# Altium project PCB_Project.PrjPcb
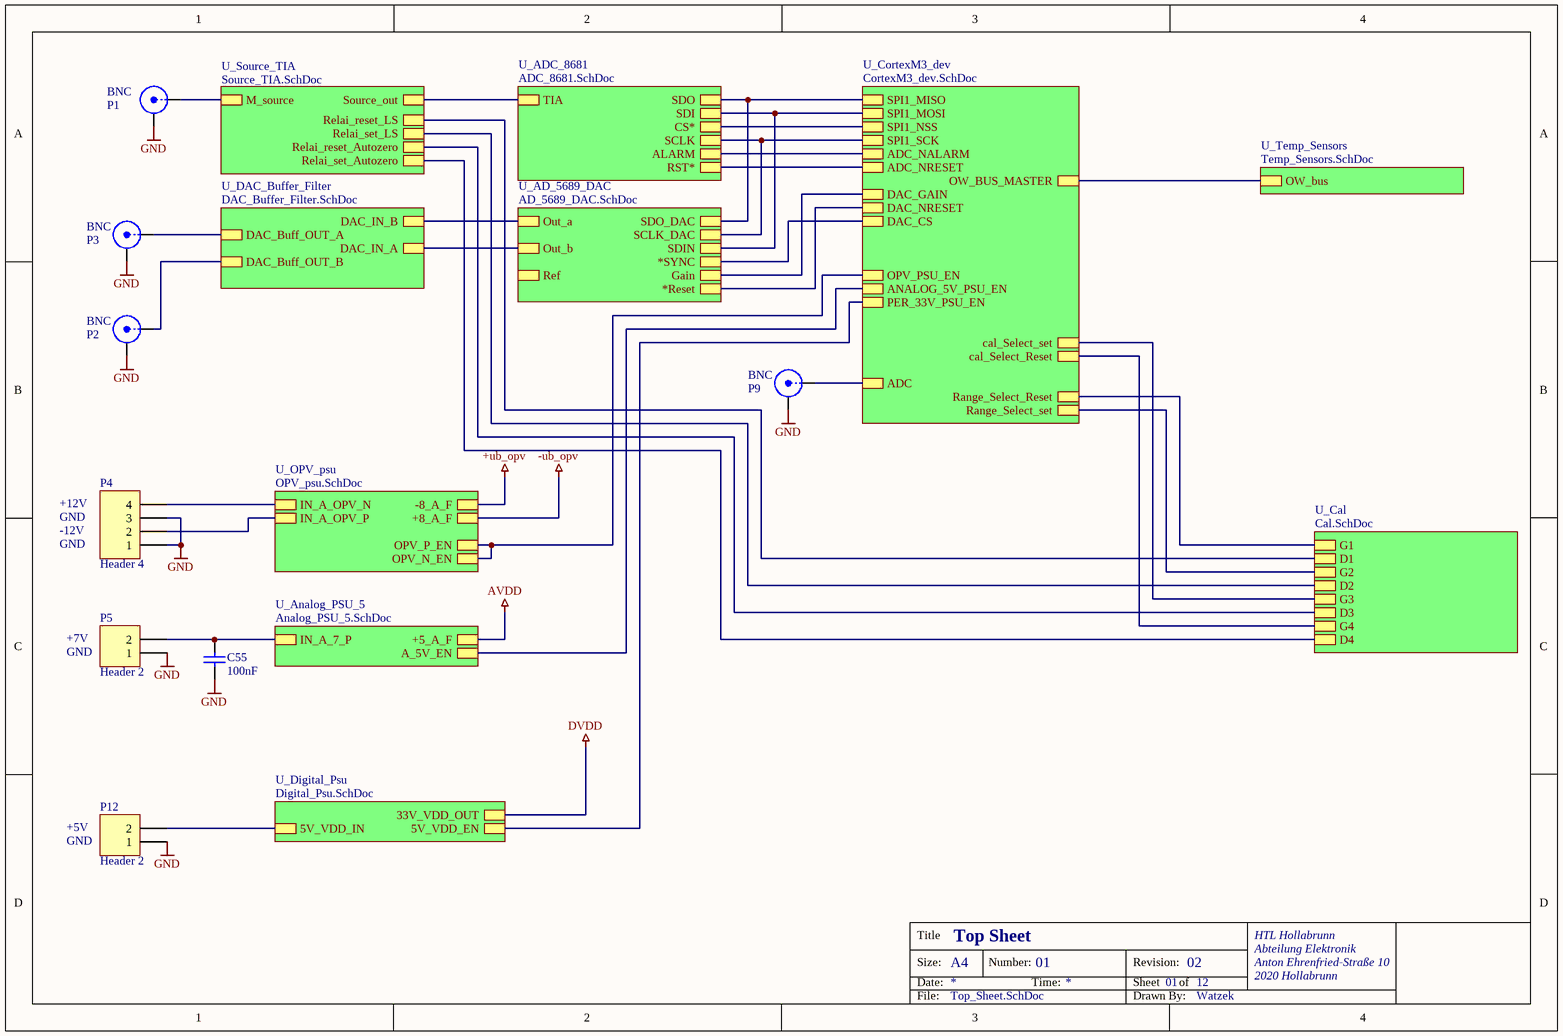
[diagram p0: Top_Sheet.SchDoc]
11 sheets, 114 parts. Net scope: hierarchical (ports join the sheet entries above them; power ports are global).
Board file: PCB1.PcbDoc
Sheets:
  Top_Sheet.SchDoc
    U_Source_TIA = Source_TIA.SchDoc
    U_DAC_Buffer_Filter = DAC_Buffer_Filter.SchDoc
    U_ADC_8681 = ADC_8681.SchDoc
    U_AD_5689_DAC = AD_5689_DAC.SchDoc
    U_Temp_Sensors = Temp_Sensors.SchDoc
    U_Digital_Psu = Digital_Psu.SchDoc
    U_Analog_PSU_5 = Analog_PSU_5.SchDoc
    U_OPV_psu = OPV_psu.SchDoc
    U_CortexM3_dev = CortexM3_dev.SchDoc
    U_Cal = Cal.SchDoc

## Sheet Top_Sheet.SchDoc: Top Sheet
size A4; ApprovedBy: Watzek; CheckedBy: Watzek; Author: Watzek; DrawnBy: Watzek; Organization: HTL Hollabrunn; Address1: Abteilung Elektronik; Address2: Anton Ehrenfried-Straße 10; Address3: 2020 Hollabrunn; DocumentNumber: 01; Revision: 02; SheetNumber: 01; SheetTotal: 12; SPICEModelCacheIHPBHSPQ: <root> / <DocumentId>IHPBHSPQ</DocumentId> / <CacheFrame Number="0"> / <Model Name="cap" Kind="MDL"> / <Text>*Default semiconductor capacitor / .MODEL CAP C()</Text> / </Model> / </CacheFrame> / </root>

### Parts
C55  100nF  [C1206-KUE]
P1  BNC  [BNC_RA CON]
P2  BNC  [BNC_RA CON]
P3  BNC  [BNC_RA CON]
P4  Header 4  [HDR1X4]
P5  Header 2  [HDR1X2]
P9  BNC  [BNC_RA CON]
P12  Header 2  [HDR1X2]

### Sub-sheets
U_AD_5689_DAC = AD_5689_DAC.SchDoc: Ref, Out_a, Out_b, SDIN, SDO_DAC, SCLK_DAC, *SYNC, Gain, *Reset
U_ADC_8681 = ADC_8681.SchDoc: SDI, CS*, SCLK, SDO, ALARM, RST*, TIA
U_Analog_PSU_5 = Analog_PSU_5.SchDoc: IN_A_7_P, +5_A_F, A_5V_EN
U_Cal = Cal.SchDoc: G1, G2, D1, D2, G3, D3, G4, D4
U_CortexM3_dev = CortexM3_dev.SchDoc: SPI1_NSS, SPI1_SCK, SPI1_MISO, SPI1_MOSI, ADC_NALARM, ADC_NRESET, DAC_GAIN, DAC_NRESET, DAC_CS, OW_BUS_MASTER, OPV_PSU_EN, ANALOG_5V_PSU_EN, PER_33V_PSU_EN, Range_Select_set, Range_Select_Reset, ADC, cal_Select_Reset, cal_Select_set
U_DAC_Buffer_Filter = DAC_Buffer_Filter.SchDoc: DAC_IN_B, DAC_Buff_OUT_B, DAC_IN_A, DAC_Buff_OUT_A
U_Digital_Psu = Digital_Psu.SchDoc: 5V_VDD_IN, 33V_VDD_OUT, 5V_VDD_EN
U_OPV_psu = OPV_psu.SchDoc: IN_A_OPV_P, +8_A_F, IN_A_OPV_N, -8_A_F, OPV_P_EN, OPV_N_EN
U_Source_TIA = Source_TIA.SchDoc: M_source, Source_out, Relai_set_LS, Relai_reset_LS, Relai_reset_Autozero, Relai_set_Autozero
U_Temp_Sensors = Temp_Sensors.SchDoc: OW_bus

### Nets
GND: C55.1 P1.2(Y) P2.2(Y) P3.2(Y) P4.1 P4.3 P5.1 P9.2(Y) P12.1
M_source: P1.1(X) ; sheet U_Source_TIA/M_source
SPI1_MISO: sheet U_ADC_8681/SDO, sheet U_AD_5689_DAC/SDO_DAC, sheet U_CortexM3_dev/SPI1_MISO
SPI1_MOSI: sheet U_ADC_8681/SDI, sheet U_AD_5689_DAC/SDIN, sheet U_CortexM3_dev/SPI1_MOSI
SPI1_SCK: sheet U_ADC_8681/SCLK, sheet U_AD_5689_DAC/SCLK_DAC, sheet U_CortexM3_dev/SPI1_SCK
NetC36_2: P12.2 ; sheet U_Digital_Psu/5V_VDD_IN
NetC47_2: P4.2 ; sheet U_OPV_psu/IN_A_OPV_P
NetC49_2: P4.4 ; sheet U_OPV_psu/IN_A_OPV_N
NetC55_2: C55.2 P5.2 ; sheet U_Analog_PSU_5/IN_A_7_P
NetD5_2: sheet U_Source_TIA/Relai_set_LS, sheet U_Cal/D2
NetD6_2: sheet U_Source_TIA/Relai_reset_LS, sheet U_Cal/D1
NetD7_2: sheet U_Source_TIA/Relai_reset_Autozero, sheet U_Cal/D3
NetD8_2: sheet U_Source_TIA/Relai_set_Autozero, sheet U_Cal/D4
NetN3_7: sheet U_Source_TIA/Source_out, sheet U_ADC_8681/TIA
NetN3_11: sheet U_ADC_8681/CS*, sheet U_CortexM3_dev/SPI1_NSS
NetN3_14: sheet U_ADC_8681/ALARM, sheet U_CortexM3_dev/ADC_NALARM
NetN4_1: sheet U_AD_5689_DAC/*Reset, sheet U_CortexM3_dev/DAC_NRESET
NetN4_2: P9.1(X) ; sheet U_CortexM3_dev/ADC
NetN4_3: sheet U_AD_5689_DAC/*SYNC, sheet U_CortexM3_dev/DAC_CS
NetN4_4: sheet U_AD_5689_DAC/Gain, sheet U_CortexM3_dev/DAC_GAIN
NetN4_9: sheet U_CortexM3_dev/cal_Select_set, sheet U_Cal/G3
NetN4_10: sheet U_CortexM3_dev/cal_Select_Reset, sheet U_Cal/G4
NetN4_11: sheet U_CortexM3_dev/Range_Select_set, sheet U_Cal/G2
NetN4_12: sheet U_CortexM3_dev/Range_Select_Reset, sheet U_Cal/G1
NetN4_13: sheet U_OPV_psu/OPV_P_EN, sheet U_OPV_psu/OPV_N_EN, sheet U_CortexM3_dev/OPV_PSU_EN
NetN4_20: sheet U_Analog_PSU_5/A_5V_EN, sheet U_CortexM3_dev/ANALOG_5V_PSU_EN
NetN4_21: sheet U_Temp_Sensors/OW_bus, sheet U_CortexM3_dev/OW_BUS_MASTER
NetN4_23: sheet U_Digital_Psu/5V_VDD_EN, sheet U_CortexM3_dev/PER_33V_PSU_EN
NetN4_27: sheet U_ADC_8681/RST*, sheet U_CortexM3_dev/ADC_NRESET
NetP2_1: P2.1(X) ; sheet U_DAC_Buffer_Filter/DAC_Buff_OUT_B
NetP3_1: P3.1(X) ; sheet U_DAC_Buffer_Filter/DAC_Buff_OUT_A
NetR19_1: sheet U_DAC_Buffer_Filter/DAC_IN_B, sheet U_AD_5689_DAC/Out_a
NetR20_1: sheet U_DAC_Buffer_Filter/DAC_IN_A, sheet U_AD_5689_DAC/Out_b

### Notes on the sheet
- +12V
- GND
- -12V
- +7V
- +5V
- Title
- Size:
- Date:
- A4
- Number:
- Time:
- Revision:
- Sheet
- of
- HTL Hollabrunn
- Abteilung Elektronik
- Anton Ehrenfried-Straße 10
- 2020 Hollabrunn
- File:
- Drawn By:

### Library data of the parts
C55 = Capacitor: Manufacturer: Kemet; Bezeichnung: Kerko +-10% 63V; Published: 8-Jun-2000; LatestRevisionDate: 17-Jul-2002; LatestRevisionNote: Re-released for DXP Platform.; PackageReference: RAD-0.3; Publisher: Altium Limited; PackageDescription: Radial Cap, Thru-Hole; 2 Leads; 0.3 in Pin Spacing; Value: 100nF; Orderingcode: *
P1-P3 P9 = BNC: BNC Elbow Connector; LatestRevisionDate: 17-Jul-2002; LatestRevisionNote: Re-released for DXP Platform.; Publisher: Altium Limited
P4 = Header 4: Header, 4-Pin; LatestRevisionDate: 17-Jul-2002; LatestRevisionNote: Re-released for DXP Platform.; Publisher: Altium Limited
P5 P12 = Header 2: Header, 2-Pin; LatestRevisionDate: 17-Jul-2002; LatestRevisionNote: Re-released for DXP Platform.; Publisher: Altium Limited

## Sheet Source_TIA.SchDoc: TIA and damper
size A4; Author: Watzek; DrawnBy: Watzek; Organization: HTL Hollabrunn; Address1: Abteilung Elektronik; Address2: Anton Ehrenfried-Straße 10; Address3: 2020 Hollabrunn; DocumentNumber: 02; Revision: 02; SheetNumber: 02; SheetTotal: 12; SPICEModelCacheBSQSHVBX: <root> / <DocumentId>BSQSHVBX</DocumentId> / <CacheFrame Number="0"> / <Model Name="cap" Kind="MDL"> / <Text>*Default semiconductor capacitor / .MODEL CAP C()</Text> / </Model> / </CacheFrame> / </root>
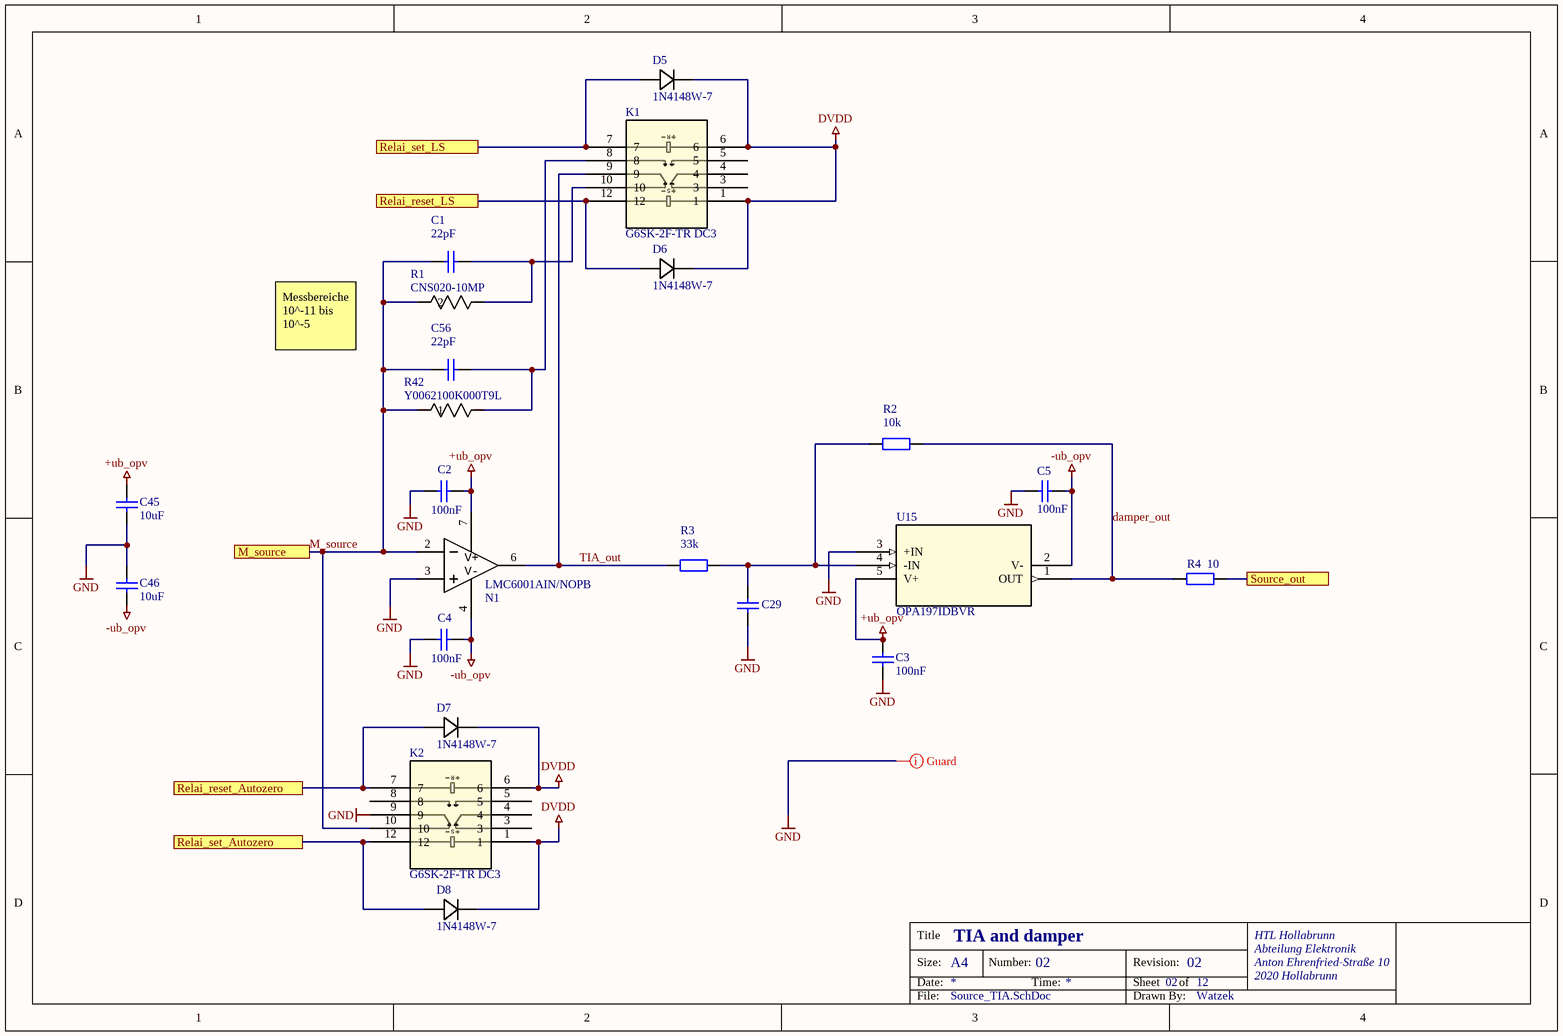
[diagram p1: Source_TIA.SchDoc]

### Parts
C1  22pF  [C1206-KUE]
C2  100nF  [C1206-KUE]
C3  100nF  [C1206-KUE]
C4  100nF  [C1206-KUE]
C5  100nF  [C1206-KUE]
C29  (no value)  [C1206-KUE]
C45  10uF  [C1206-KUE]
C46  10uF  [C1206-KUE]
C56  22pF  [C1206-KUE]
D5  1N4148W-7  [SOD123_DIO]
D6  1N4148W-7  [SOD123_DIO]
D7  1N4148W-7  [SOD123_DIO]
D8  1N4148W-7  [SOD123_DIO]
K1  G6SK-2F-TR DC3  [RELAY_G6SK-2F DC3_OMR]
K2  G6SK-2F-TR DC3  [RELAY_G6SK-2F DC3_OMR]
N1  LMC6001AIN/NOPB  [DIP8]
R1  CNS020-10MP  [RES_CNS020_VIS]
R2  10k  [C1206-KUE]
R3  33k  [C1206-KUE]
R4  10  [C1206-KUE]
R42  Y0062100K000T9L  [RES_S102K_7P62X2P67_VIS]
U15  OPA197IDBVR  [DBV5_TEX]

### Ports
M_source, Relai_reset_Autozero, Relai_reset_LS, Relai_set_Autozero, Relai_set_LS, Source_out

### Nets
+ub_opv: C2.2 C3.2 C45.2 N1.7(V+) U15.5(V+)  [project net neg_out]
-ub_opv: C4.2 C5.2 C46.1 N1.4(V-) U15.2(V-)  [project net pos_out]
DVDD: D5.1 D6.1 D7.1 D8.1 K1.1 K1.6 K2.1 K2.6
GND: C2.1 C3.1 C4.1 C5.1 C29.1 C45.1 C46.2 K2.9 N1.3(IN+) U15.3(+IN)
damper_out: R2.1 R4.2 U15.1(OUT)
M_source: C1.1 C56.1 K2.10 N1.2(IN-) R1.2 R42.1 ; port M_source
TIA_out: K1.9 N1.6(OUT) R3.2
NetC1_2: C1.2 K1.10 R1.1
NetC29_2: C29.2 R2.2 R3.1 U15.4(-IN)
NetC56_2: C56.2 K1.8 R42.2
NetD5_2: D5.2 K1.7 ; port Relai_set_LS
NetD6_2: D6.2 K1.12 ; port Relai_reset_LS
NetD7_2: D7.2 K2.7 ; port Relai_reset_Autozero
NetD8_2: D8.2 K2.12 ; port Relai_set_Autozero
NetN3_7: R4.1 ; port Source_out

Not connected (* = marked no-connect by the designer): K1 3 4 5; K2 3 4 5 8

### Layout directives
mark named Guard: GND

### Notes on the sheet
- Messbereiche 10^-11 bis 10^-5
- Title
- Size:
- Date:
- A4
- Number:
- Time:
- Revision:
- Sheet
- of
- HTL Hollabrunn
- Abteilung Elektronik
- Anton Ehrenfried-Straße 10
- 2020 Hollabrunn
- File:
- Drawn By:
- (in symbol G6SK-2F-TR DC3) R; S

### Library data of the parts
C1-C5 C29 C45 C46 C56 = Capacitor: as C55 on sheet Top_Sheet; Published: 8-Jun-2000; LatestRevisionDate: 17-Jul-2002; LatestRevisionNote: Re-released for DXP Platform.; PackageReference: RAD-0.3; Publisher: Altium Limited; PackageDescription: Radial Cap, Thru-Hole; 2 Leads; 0.3 in Pin Spacing; Orderingcode: *
  C1 C56: Value: 22pF
  C2-C5: Value: 100nF
  C45 C46: Value: 10uF
D5-D8 = 1N4148W-7: Description; Manufacturer_Name: Diodes Inc; Copyright: Copyright (C) 2026 Ultra Librarian. All rights reserved.; Manufacturer_Part_Number: 1N4148W-7
K1 K2 = G6SK-2F-TR DC3: Description; Manufacturer_Name: Omron; Copyright: Copyright (C) 2026 Ultra Librarian. All rights reserved.; Manufacturer_Part_Number: G6SK-2F-TR DC3; Type: Type; RefDes: RefDes
N1 = LMC6001AINNOPB: Ultra-Low Input Current Amplifier 8-PDIP -40 to 85; Manufacturer_Name: Texas Instruments; Manufacturer: NationalSemiconductor; Characteristics: LMC6001AINUltra-LowInputBiasCurrentOpAmp; CompType: OpAmpIC; TaMin_C: -400; TaMax_C: 850; ComponentLink1DescBC: LMC6001Datasheet; ComponentLink2DescA4: LMC6001WebPage; ComponentLink3DescAC: N08EPackageWebPage; Copyright: Copyright (C) 2025 Ultra Librarian. All rights reserved.; Manufacturer_Part_Number: LMC6001AIN/NOPB; SymbolVersion: 2008-07-09; PartNumber: LMC6001AIN; PackageDescription: 8LeadPlasticDIP; PackageReference: N08E_L; RoHS: O; ComponentLink1URL: http//wwwnationalcom/ds/LM/LMC6001pdf; ComponentLink2URL: http//wwwnationalcom/pf/LM/LMC6001html; ComponentLink3URL: http//wwwnationalcom/packaging/folders/n08ehtml; Version: B1608; LatestRevisionDate: 2009-03-16; LatestRevisionNote: MassUpdate; Publisher: NationalSemiconductor; Published: 2009-03-16
R1 = CNS020-10KP: CNS 020 10K 0,02% e2; Manufacturer_Name: Vishay; Copyright: Copyright (C) 2026 Ultra Librarian. All rights reserved.; Manufacturer_Part_Number: CNS020-10KP; Datasheet: https://www.vishay.com/doc?60051
R2-R4 = ResistorSMD: Resistor SMD; Manufacturer: AVX; Bezeichnung: SMD Wid. 1/8W 2%; Published: 8-Jun-2000; LatestRevisionDate: 17-Jul-2002; LatestRevisionNote: Re-released for DXP Platform.; PackageReference: AXIAL-0.4; Publisher: Altium Limited; PackageDescription: Axial Device, Thru-Hole; 2 Leads; 0.4 in Pin Spacing; Orderingcode: *
  R2: Value: 10k
  R3: Value: 33k
  R4: Value: 10
R42 = Y0062100K000T9L: No Description Available; Manufacturer_Name: Vishay; Copyright: Copyright (C) 2026 Ultra Librarian. All rights reserved.; Manufacturer_Part_Number: Y0062100K000T9L
U15 = OPA197IDBVR: Single, 36-V, precision, rail-to-rail input output, low offset voltage op amp 5-SOT-23 -40 to 125; Manufacturer_Name: Texas Instruments; Copyright: Copyright (C) 2025 Ultra Librarian. All rights reserved.; Manufacturer_Part_Number: OPA197IDBVR; RefDes: RefDes; Type: Type

## Sheet DAC_Buffer_Filter.SchDoc: DAC Buffer
size A4; DrawnBy: Michael Watzek; Organization: HTL Hollabrunn; Address1: Abteilung Elektronik; Address2: Anton Ehrenfried-Straße 10; Address3: 2020 Hollabrunn; DocumentNumber: 09; Revision: 01; SheetNumber: 09; SheetTotal: 12; SPICEModelCacheDRLOHMHD: <root> / <DocumentId>DRLOHMHD</DocumentId> / <CacheFrame Number="0"> / <Model Name="cap" Kind="MDL"> / <Text>*Default semiconductor capacitor / .MODEL CAP C()</Text> / </Model> / </CacheFrame> / </root>
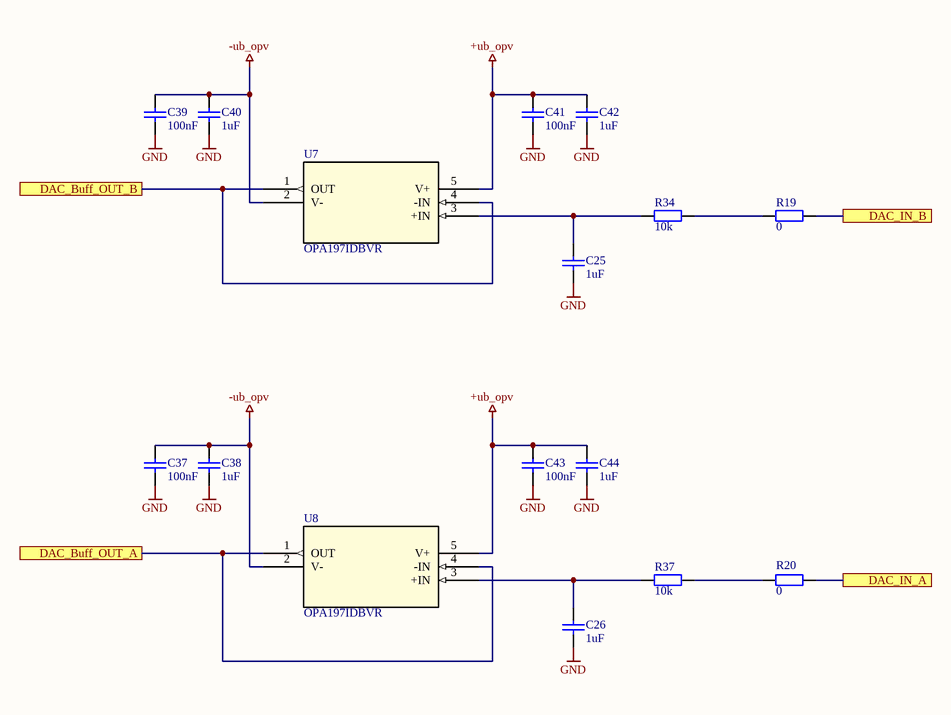
[diagram p2: DAC_Buffer_Filter.SchDoc]

### Parts
C25  1uF  [C1206-KUE]
C26  1uF  [C1206-KUE]
C37  100nF  [C1206-KUE]
C38  1uF  [C1206-KUE]
C39  100nF  [C1206-KUE]
C40  1uF  [C1206-KUE]
C41  100nF  [C1206-KUE]
C42  1uF  [C1206-KUE]
C43  100nF  [C1206-KUE]
C44  1uF  [C1206-KUE]
R19  0  [C1206-KUE]
R20  0  [C1206-KUE]
R34  10k  [C1206-KUE]
R37  10k  [C1206-KUE]
U7  OPA197IDBVR  [DBV5_TEX]
U8  OPA197IDBVR  [DBV5_TEX]

### Ports
DAC_Buff_OUT_A, DAC_Buff_OUT_B, DAC_IN_A, DAC_IN_B

### Nets
+ub_opv: C41.2 C42.2 C43.2 C44.2 U7.5(V+) U8.5(V+)  [project net neg_out]
-ub_opv: C37.2 C38.2 C39.2 C40.2 U7.2(V-) U8.2(V-)  [project net pos_out]
GND: C25.1 C26.1 C37.1 C38.1 C39.1 C40.1 C41.1 C42.1 C43.1 C44.1
NetC25_2: C25.2 R34.2 U7.3(+IN)
NetC26_2: C26.2 R37.2 U8.3(+IN)
NetP2_1: U7.1(OUT) U7.4(-IN) ; port DAC_Buff_OUT_B
NetP3_1: U8.1(OUT) U8.4(-IN) ; port DAC_Buff_OUT_A
NetR19_1: R19.1 ; port DAC_IN_B
NetR19_2: R19.2 R34.1
NetR20_1: R20.1 ; port DAC_IN_A
NetR20_2: R20.2 R37.1

### Notes on the sheet
- Title
- Size:
- Date:
- A4
- Number:
- Time:
- Revision:
- Sheet
- of
- HTL Hollabrunn
- Abteilung Elektronik
- Anton Ehrenfried-Straße 10
- 2020 Hollabrunn
- File:
- Drawn By:

### Library data of the parts
C25 C26 C37-C44 = Capacitor: as C55 on sheet Top_Sheet; Published: 8-Jun-2000; LatestRevisionDate: 17-Jul-2002; LatestRevisionNote: Re-released for DXP Platform.; PackageReference: RAD-0.3; Publisher: Altium Limited; PackageDescription: Radial Cap, Thru-Hole; 2 Leads; 0.3 in Pin Spacing; Orderingcode: *
  C25 C26 C38 C40 C42 C44: Value: 1uF
  C37 C39 C41 C43: Value: 100nF
R19 R20 R34 R37 = ResistorSMD: as R2 on sheet Source_TIA; Published: 8-Jun-2000; LatestRevisionDate: 17-Jul-2002; LatestRevisionNote: Re-released for DXP Platform.; PackageReference: AXIAL-0.4; Publisher: Altium Limited; PackageDescription: Axial Device, Thru-Hole; 2 Leads; 0.4 in Pin Spacing; Orderingcode: *
  R19 R20: Value: 0
  R34 R37: Value: 10k
U7 U8 = OPA197IDBVR: as U15 on sheet Source_TIA; Copyright: Copyright (C) 2025 Ultra Librarian. All rights reserved.; Manufacturer_Part_Number: OPA197IDBVR; RefDes: RefDes; Type: Type

## Sheet ADC_8681.SchDoc: source ADC
size A4; Author: Watzek; DrawnBy: Watzek; Organization: HTL Hollabrunn; Address1: Abteilung Elektronik; Address2: Anton Ehrenfried-Straße 10; Address3: 2020 Hollabrunn; DocumentNumber: 04; Revision: 01; SheetNumber: 04; SheetTotal: 12; SPICEModelCacheSWPEVHXS: <root> / <DocumentId>SWPEVHXS</DocumentId> / <CacheFrame Number="0"> / <Model Name="cap" Kind="MDL"> / <Text>*Default semiconductor capacitor / .MODEL CAP C()</Text> / </Model> / </CacheFrame> / </root>
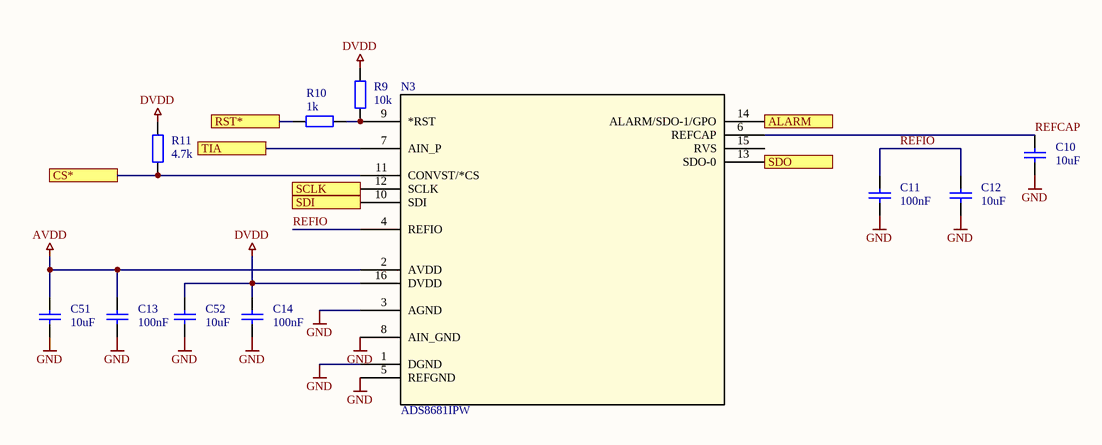
[diagram p3: ADC_8681.SchDoc]

### Parts
C10  10uF  [C1206-KUE]
C11  100nF  [C1206-KUE]
C12  10uF  [C1206-KUE]
C13  100nF  [C1206-KUE]
C14  100nF  [C1206-KUE]
C51  10uF  [C1206-KUE]
C52  10uF  [C1206-KUE]
N3  ADS8681IPW  [PW16_TEX]
R9  10k  [C1206-KUE]
R10  1k  [C1206-KUE]
R11  4.7k  [C1206-KUE]

### Ports
ALARM, CS*, RST*, SCLK, SDI, SDO, TIA

### Nets
AVDD: C13.2 C51.2 N3.2(AVDD)
DVDD: C14.2 C52.2 N3.16(DVDD) R9.1 R11.1
GND: C10.1 C11.1 C12.1 C13.1 C14.1 C51.1 C52.1 N3.1(DGND) N3.3(AGND) N3.5(REFGND) N3.8(AIN_GND)
REFCAP: C10.2 N3.6(REFCAP)
REFIO: C11.2 C12.2 N3.4(REFIO)
SPI1_MISO: N3.13(SDO-0) ; port SDO
SPI1_MOSI: N3.10(SDI) ; port SDI
SPI1_SCK: N3.12(SCLK) ; port SCLK
NetN3_7: N3.7(AIN_P) ; port TIA
NetN3_9: N3.9(*RST) R9.2 R10.2
NetN3_11: N3.11(CONVST/*CS) R11.2 ; port CS*
NetN3_14: N3.14(ALARM/SDO-1/GPO) ; port ALARM
NetN4_27: R10.1 ; port RST*

Not connected (* = marked no-connect by the designer): N3 15(RVS)

### Notes on the sheet
- Title
- Size:
- Date:
- A4
- Number:
- Time:
- Revision:
- Sheet
- of
- HTL Hollabrunn
- Abteilung Elektronik
- Anton Ehrenfried-Straße 10
- 2020 Hollabrunn
- File:
- Drawn By:

### Library data of the parts
C10-C14 C51 C52 = Capacitor: as C55 on sheet Top_Sheet; Published: 8-Jun-2000; LatestRevisionDate: 17-Jul-2002; LatestRevisionNote: Re-released for DXP Platform.; PackageReference: RAD-0.3; Publisher: Altium Limited; PackageDescription: Radial Cap, Thru-Hole; 2 Leads; 0.3 in Pin Spacing; Orderingcode: *
  C10 C12 C51 C52: Value: 10uF
  C11 C13 C14: Value: 100nF
N3 = ADS8681IPW: 16-bit, 1MSPS 1-ch SAR ADC with programmable (Â±12V, Â±10V, Â±6V, Â±5V, Â±2.5V) input ranges on 5V supply 16-TSSOP -40 to 125; Manufacturer_Name: Texas Instruments; Copyright: Copyright (C) 2025 Ultra Librarian. All rights reserved.; Manufacturer_Part_Number: ADS8681IPW; RefDes: RefDes; Type: Type
R9-R11 = ResistorSMD: as R2 on sheet Source_TIA; Published: 8-Jun-2000; LatestRevisionDate: 17-Jul-2002; LatestRevisionNote: Re-released for DXP Platform.; PackageReference: AXIAL-0.4; Publisher: Altium Limited; PackageDescription: Axial Device, Thru-Hole; 2 Leads; 0.4 in Pin Spacing; Orderingcode: *
  R9: Value: 10k
  R10: Value: 1k
  R11: Value: 4.7k

## Sheet AD_5689_DAC.SchDoc: DAC for Gate / Drain
size A4; Author: Watzek; DrawnBy: Watzek; Organization: HTL Hollabrunn; Address1: Abteilung Elektronik; Address2: Anton Ehrenfried-Straße 10; Address3: 2020 Hollabrunn; DocumentNumber: 05; Revision: 01; SheetNumber: 05; SheetTotal: 12; SPICEModelCacheXXRROZRR: <root> / <DocumentId>XXRROZRR</DocumentId> / <CacheFrame Number="0"> / <Model Name="cap" Kind="MDL"> / <Text>*Default semiconductor capacitor / .MODEL CAP C()</Text> / </Model> / </CacheFrame> / </root>
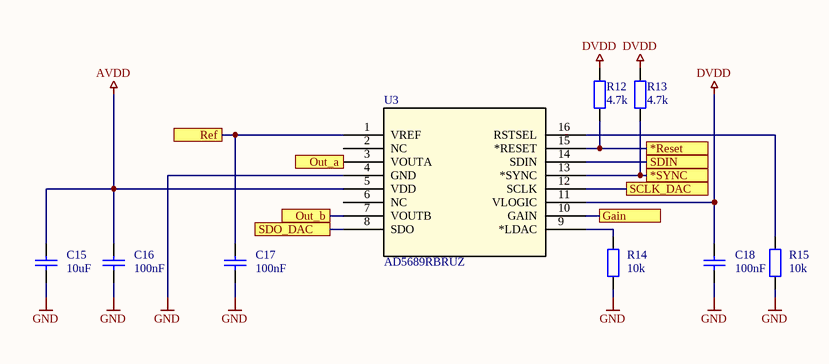
[diagram p4: AD_5689_DAC.SchDoc]

### Parts
C15  10uF  [C1206-KUE]
C16  100nF  [C1206-KUE]
C17  100nF  [C1206-KUE]
C18  100nF  [C1206-KUE]
R12  4.7k  [C1206-KUE]
R13  4.7k  [C1206-KUE]
R14  10k  [C1206-KUE]
R15  10k  [C1206-KUE]
U3  AD5689RBRUZ  [RU_16_ADI]

### Ports
*Reset, *SYNC, Gain, Out_a, Out_b, Ref, SCLK_DAC, SDIN, SDO_DAC

### Nets
AVDD: C15.2 C16.2 U3.5(VDD)
DVDD: C18.2 R12.1 R13.1 U3.11(VLOGIC)
GND: C15.1 C16.1 C17.1 C18.1 R14.2 R15.2 U3.4(GND)
SPI1_MISO: U3.8(SDO) ; port SDO_DAC
SPI1_MOSI: U3.14(SDIN) ; port SDIN
SPI1_SCK: U3.12(SCLK) ; port SCLK_DAC
NetC17_2: C17.2 U3.1(VREF) ; port Ref
NetN4_1: R12.2 U3.15(*RESET) ; port *Reset
NetN4_3: R13.2 U3.13(*SYNC) ; port *SYNC
NetN4_4: U3.10(GAIN) ; port Gain
NetR14_1: R14.1 U3.9(*LDAC)
NetR15_1: R15.1 U3.16(RSTSEL)
NetR19_1: U3.3(VOUTA) ; port Out_a
NetR20_1: U3.7(VOUTB) ; port Out_b

Not connected (* = marked no-connect by the designer): U3 2(NC) 6(NC)

### Notes on the sheet
- Title
- Size:
- Date:
- A4
- Number:
- Time:
- Revision:
- Sheet
- of
- HTL Hollabrunn
- Abteilung Elektronik
- Anton Ehrenfried-Straße 10
- 2020 Hollabrunn
- File:
- Drawn By:

### Library data of the parts
C15-C18 = Capacitor: as C55 on sheet Top_Sheet; Published: 8-Jun-2000; LatestRevisionDate: 17-Jul-2002; LatestRevisionNote: Re-released for DXP Platform.; PackageReference: RAD-0.3; Publisher: Altium Limited; PackageDescription: Radial Cap, Thru-Hole; 2 Leads; 0.3 in Pin Spacing; Orderingcode: *
  C15: Value: 10uF
  C16-C18: Value: 100nF
R12-R15 = ResistorSMD: as R2 on sheet Source_TIA; Published: 8-Jun-2000; LatestRevisionDate: 17-Jul-2002; LatestRevisionNote: Re-released for DXP Platform.; PackageReference: AXIAL-0.4; Publisher: Altium Limited; PackageDescription: Axial Device, Thru-Hole; 2 Leads; 0.4 in Pin Spacing; Orderingcode: *
  R12 R13: Value: 4.7k
  R14 R15: Value: 10k
U3 = AD5689RBRUZ: Dual, 16-Bit nanoDAC+ with 2 ppm/Â°C Reference, SPI Interface; Manufacturer_Name: Analog Devices Inc; Copyright: Copyright (C) 2026 Ultra Librarian. All rights reserved.; Manufacturer_Part_Number: AD5689RBRUZ; RefDes: RefDes; Type: Type

## Sheet Temp_Sensors.SchDoc: One Wire Devices
size A4; DrawnBy: Michael Watzek; Organization: HTL Hollabrunn; Address1: Abteilung Elektronik; Address2: Anton Ehrenfried-Straße 10; Address3: 2020 Hollabrunn; DocumentNumber: 10; Revision: 01; SheetNumber: 10; SheetTotal: 12
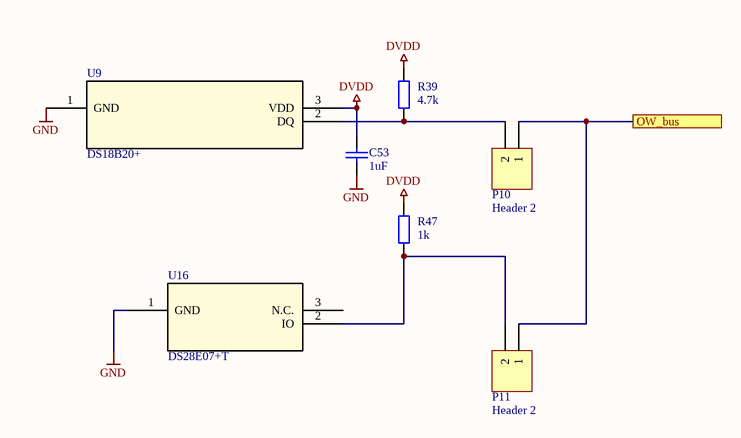
[diagram p5: Temp_Sensors.SchDoc]

### Parts
C53  1uF  [C1206-KUE]
P10  Header 2  [HDR1X2]
P11  Header 2  [HDR1X2]
R39  4.7k  [C1206-KUE]
R47  1k  [C1206-KUE]
U9  DS18B20+  [21-0248A_Q3-1_MXM]
U16  DS28E07+T  [21-0250_Q3+4_MXM]

### Ports
OW_bus

### Nets
DVDD: C53.2 R39.1 R47.1 U9.3(VDD)
GND: C53.1 U9.1(GND) U16.1(GND)
NetN4_21: P10.1 P11.1 ; port OW_bus
NetP10_2: P10.2 R39.2 U9.2(DQ)
NetP11_2: P11.2 R47.2 U16.2(IO)

Not connected (* = marked no-connect by the designer): U16 3(N.C.)

### Notes on the sheet
- Title
- Size:
- Date:
- A4
- Number:
- Time:
- Revision:
- Sheet
- of
- HTL Hollabrunn
- Abteilung Elektronik
- Anton Ehrenfried-Straße 10
- 2020 Hollabrunn
- File:
- Drawn By:

### Library data of the parts
C53 = Capacitor: as C55 on sheet Top_Sheet; Published: 8-Jun-2000; LatestRevisionDate: 17-Jul-2002; LatestRevisionNote: Re-released for DXP Platform.; PackageReference: RAD-0.3; Publisher: Altium Limited; PackageDescription: Radial Cap, Thru-Hole; 2 Leads; 0.3 in Pin Spacing; Value: 1uF; Orderingcode: *
P10 P11 = Header 2: Header, 2-Pin; LatestRevisionDate: 17-Jul-2002; LatestRevisionNote: Re-released for DXP Platform.; Publisher: Altium Limited
R39 R47 = ResistorSMD: as R2 on sheet Source_TIA; Published: 8-Jun-2000; LatestRevisionDate: 17-Jul-2002; LatestRevisionNote: Re-released for DXP Platform.; PackageReference: AXIAL-0.4; Publisher: Altium Limited; PackageDescription: Axial Device, Thru-Hole; 2 Leads; 0.4 in Pin Spacing; Orderingcode: *
  R39: Value: 4.7k
  R47: Value: 1k
U9 = DS18B20+: Programmable Resolution 1-Wire Digital Thermometer; Manufacturer_Name: Analog Devices Inc; Copyright: Copyright (C) 2025 Ultra Librarian. All rights reserved.; Manufacturer_Part_Number: DS18B20+; RefDes: RefDes; Type: Type
U16 = DS28E07+T: 1024-Bit, 1-Wire EEPROM; Manufacturer_Name: Analog Devices Inc; Copyright: Copyright (C) 2026 Ultra Librarian. All rights reserved.; Manufacturer_Part_Number: DS28E07+T; RefDes: RefDes; Type: Type

## Sheet Digital_Psu.SchDoc: Digital PSU
size A4; DrawnBy: Michael Watzek; Organization: HTL Hollabrunn; Address1: Abteilung Elektronik; Address2: Anton Ehrenfried-Straße 10; Address3: 2020 Hollabrunn; DocumentNumber: 07; Revision: 02; SheetNumber: 07; SheetTotal: 12; SPICEModelCacheAWIPVUZH: <root> / <DocumentId>AWIPVUZH</DocumentId> / <CacheFrame Number="0"> / <Model Name="cap" Kind="MDL"> / <Text>*Default semiconductor capacitor / .MODEL CAP C()</Text> / </Model> / </CacheFrame> / </root>
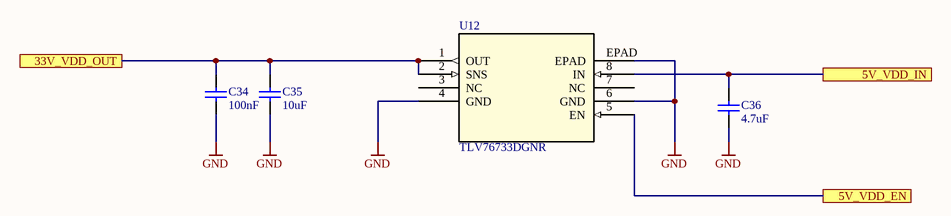
[diagram p6: Digital_Psu.SchDoc]

### Parts
C34  100nF  [C1206-KUE]
C35  10uF  [C1206-KUE]
C36  4.7uF  [C1206-KUE]
U12  TLV76733DGNR  [VSSOP8_DGN_TEX]

### Ports
5V_VDD_EN, 5V_VDD_IN, 33V_VDD_OUT

### Nets
DVDD: C34.2 C35.2 U12.1(OUT) U12.2(SNS) ; port 33V_VDD_OUT
GND: C34.1 C35.1 C36.1 U12.4(GND) U12.6(GND) U12.EPAD
NetC36_2: C36.2 U12.8(IN) ; port 5V_VDD_IN
NetN4_23: U12.5(EN) ; port 5V_VDD_EN

Not connected (* = marked no-connect by the designer): U12 3(NC) 7(NC)

### Notes on the sheet
- Title
- Size:
- Date:
- A4
- Number:
- Time:
- Revision:
- Sheet
- of
- HTL Hollabrunn
- Abteilung Elektronik
- Anton Ehrenfried-Straße 10
- 2020 Hollabrunn
- File:
- Drawn By:

### Library data of the parts
C34-C36 = Capacitor: as C55 on sheet Top_Sheet; Published: 8-Jun-2000; LatestRevisionDate: 17-Jul-2002; LatestRevisionNote: Re-released for DXP Platform.; PackageReference: RAD-0.3; Publisher: Altium Limited; PackageDescription: Radial Cap, Thru-Hole; 2 Leads; 0.3 in Pin Spacing; Orderingcode: *
  C34: Value: 100nF
  C35: Value: 10uF
  C36: Value: 4.7uF
U12 = TLV76733DGNR: Adjustable- and fixed-output, 1-A, 16-V, positive-voltage low-dropout (LDO) linear regulator 8-HVSSOP -40 to 125; Manufacturer_Name: Texas Instruments; Type: Power Management; Copyright: Copyright (C) 2025 Ultra Librarian. All rights reserved.; Manufacturer_Part_Number: TLV76733DGNR; RefDes: RefDes

## Sheet Analog_PSU_5.SchDoc: Analog PSU
size A4; DrawnBy: Michael Watzek; Organization: HTL Hollabrunn; Address1: Abteilung Elektronik; Address2: Anton Ehrenfried-Straße 10; Address3: 2020 Hollabrunn; DocumentNumber: 11; Revision: 02; SheetNumber: 11; SheetTotal: 12; SPICEModelCacheRYPOANGS: <root> / <DocumentId>RYPOANGS</DocumentId> / <CacheFrame Number="0"> / <Model Name="cap" Kind="MDL"> / <Text>*Default semiconductor capacitor / .MODEL CAP C()</Text> / </Model> / </CacheFrame> / </root>
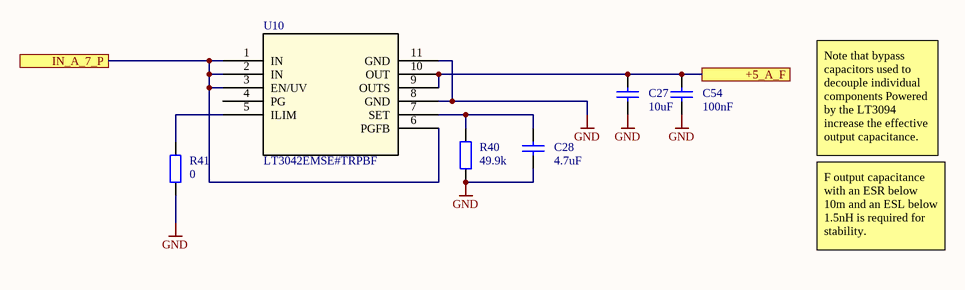
[diagram p7: Analog_PSU_5.SchDoc]

### Parts
C27  10uF  [C1206-KUE]
C28  4.7uF  [C1206-KUE]
C54  100nF  [C1206-KUE]
R40  49.9k  [C1206-KUE]
R41  0  [C1206-KUE]
U10  LT3042EMSE#TRPBF  [05-08-1664_ADI]

### Ports
+5_A_F, IN_A_7_P

### Nets
AVDD: C27.2 C54.2 U10.9(OUTS) U10.10(OUT) ; port +5_A_F
GND: C27.1 C28.1 C54.1 R40.2 R41.2 U10.8(GND) U10.11(GND)
NetC28_2: C28.2 R40.1 U10.7(SET)
NetC55_2: U10.1(IN) U10.2(IN) U10.3(EN/UV) U10.6(PGFB) ; port IN_A_7_P
NetR41_1: R41.1 U10.5(ILIM)

Not connected (* = marked no-connect by the designer): U10 4(PG)

### Notes on the sheet
- Note that bypass capacitors used to decouple individual components Powered by the LT3094 increase the effective output capacitance.
- F output capacitance with an ESR below 10m and an ESL below 1.5nH is required for stability.
- Title
- Size:
- Date:
- A4
- Number:
- Time:
- Revision:
- Sheet
- of
- HTL Hollabrunn
- Abteilung Elektronik
- Anton Ehrenfried-Straße 10
- 2020 Hollabrunn
- File:
- Drawn By:

### Library data of the parts
C27 C28 C54 = Capacitor: as C55 on sheet Top_Sheet; Published: 8-Jun-2000; LatestRevisionDate: 17-Jul-2002; LatestRevisionNote: Re-released for DXP Platform.; PackageReference: RAD-0.3; Publisher: Altium Limited; PackageDescription: Radial Cap, Thru-Hole; 2 Leads; 0.3 in Pin Spacing; Orderingcode: *
  C27: Value: 10uF
  C28: Value: 4.7uF
  C54: Value: 100nF
R40 R41 = ResistorSMD: as R2 on sheet Source_TIA; Published: 8-Jun-2000; LatestRevisionDate: 17-Jul-2002; LatestRevisionNote: Re-released for DXP Platform.; PackageReference: AXIAL-0.4; Publisher: Altium Limited; PackageDescription: Axial Device, Thru-Hole; 2 Leads; 0.4 in Pin Spacing; Orderingcode: *
  R40: Value: 49.9k
  R41: Value: 0
U10 = LT3042EMSETRPBF: 20V, 200mA, Ultralow Noise, Ultrahigh PSRR RF Linear Regulator; Manufacturer_Name: Analog Devices Inc; Type: Power Management; Copyright: Copyright (C) 2025 Ultra Librarian. All rights reserved.; Manufacturer_Part_Number: LT3042EMSE#TRPBF; RefDes: RefDes

## Sheet OPV_psu.SchDoc: OPV Power supply
size A4; DrawnBy: Watzek; Organization: HTL Hollabrunn; Address1: Abteilung Elektronik; Address2: Anton Ehrenfried-Straße 10; Address3: 2020 Hollabrunn; DocumentNumber: 03; Revision: 01; SheetNumber: 03; SheetTotal: 12; SPICEModelCacheVBIYTPZR: <root> / <DocumentId>VBIYTPZR</DocumentId> / <CacheFrame Number="0"> / <Model Name="cap" Kind="MDL"> / <Text>*Default semiconductor capacitor / .MODEL CAP C()</Text> / </Model> / </CacheFrame> / </root>
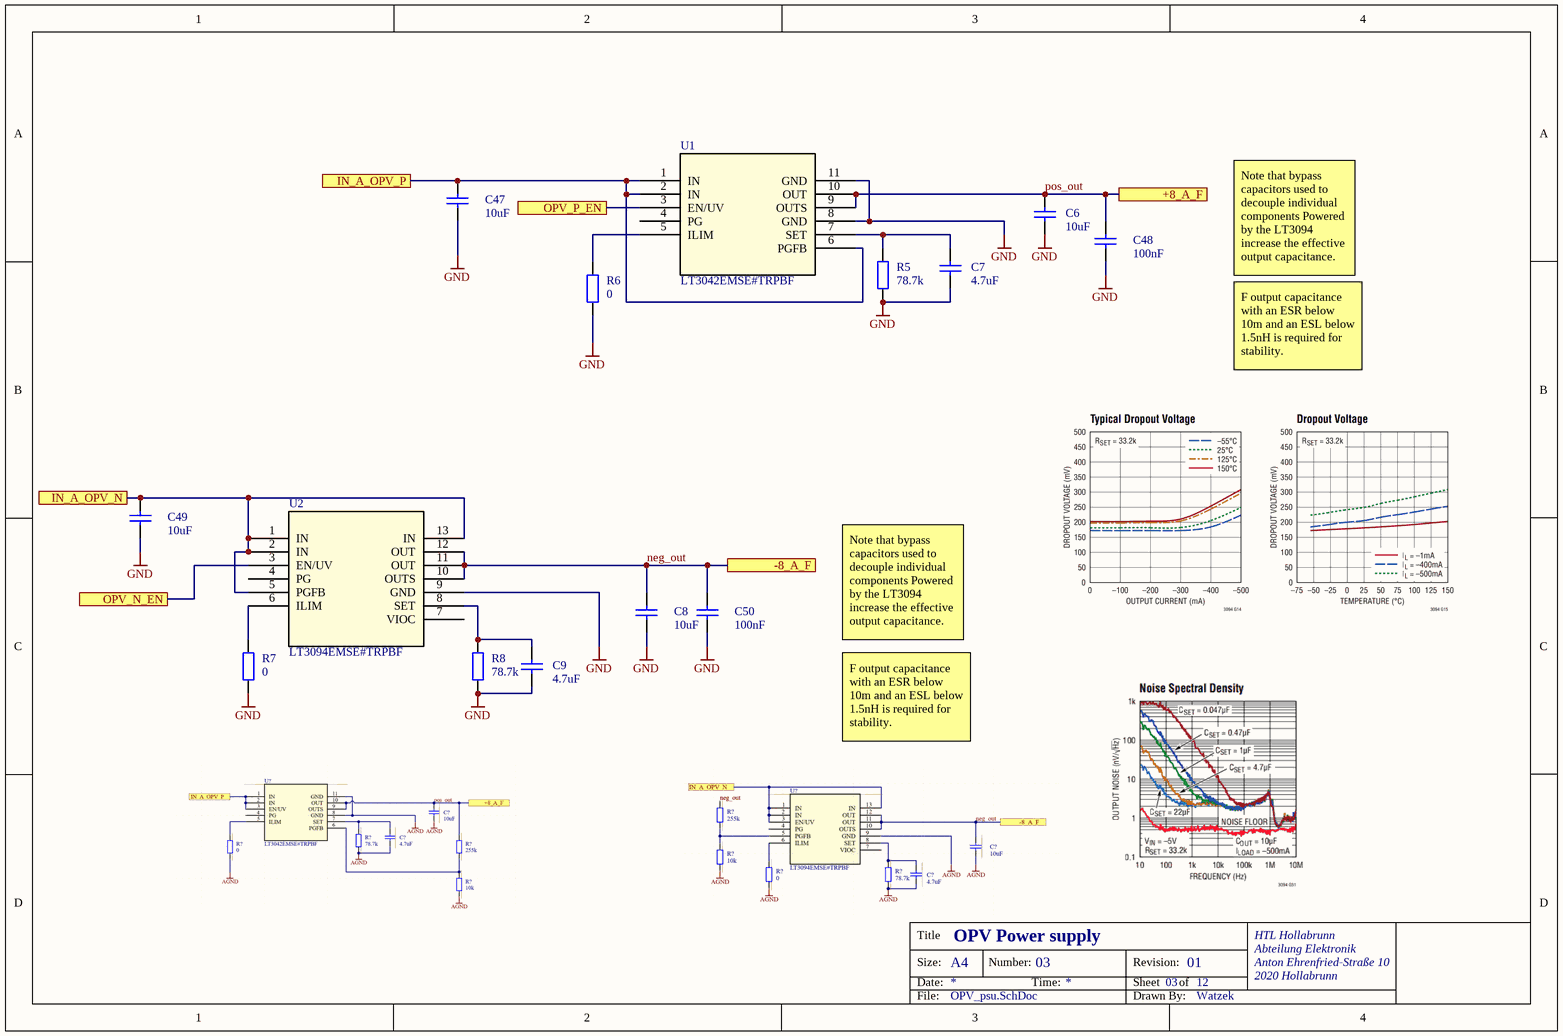
[diagram p8: OPV_psu.SchDoc]

### Parts
C6  10uF  [C1206-KUE]
C7  4.7uF  [C1206-KUE]
C8  10uF  [C1206-KUE]
C9  4.7uF  [C1206-KUE]
C47  10uF  [C1206-KUE]
C48  100nF  [C1206-KUE]
C49  10uF  [C1206-KUE]
C50  100nF  [C1206-KUE]
R5  78.7k  [C1206-KUE]
R6  0  [C1206-KUE]
R7  0  [C1206-KUE]
R8  78.7k  [C1206-KUE]
U1  LT3042EMSE#TRPBF  [05-08-1664_ADI]
U2  LT3094EMSE#TRPBF  [MSE_05-08-1666_ADI]

### Ports
+8_A_F, -8_A_F, IN_A_OPV_N, IN_A_OPV_P, OPV_N_EN, OPV_P_EN

### Nets
GND: C6.1 C7.1 C8.1 C9.1 C47.1 C48.1 C49.1 C50.1 R5.2 R6.2 R7.2 R8.2 U1.8(GND) U1.11(GND) U2.9(GND)
neg_out: C8.2 C50.2 U2.10(OUTS) U2.11(OUT) U2.12(OUT) ; port -8_A_F
pos_out: C6.2 C48.2 U1.9(OUTS) U1.10(OUT) ; port +8_A_F
NetC7_2: C7.2 R5.1 U1.7(SET)
NetC9_2: C9.2 R8.1 U2.8(SET)
NetC47_2: C47.2 U1.1(IN) U1.2(IN) U1.6(PGFB) ; port IN_A_OPV_P
NetC49_2: C49.2 U2.1(IN) U2.2(IN) U2.5(PGFB) U2.13(IN) ; port IN_A_OPV_N
NetN4_13: U1.3(EN/UV) U2.3(EN/UV) ; port OPV_P_EN, port OPV_N_EN
NetR6_1: R6.1 U1.5(ILIM)
NetR7_1: R7.1 U2.6(ILIM)

Not connected (* = marked no-connect by the designer): U1 4(PG); U2 4(PG) 7(VIOC)

### Notes on the sheet
- Note that bypass capacitors used to decouple individual components Powered by the LT3094 increase the effective output capacitance.
- F output capacitance with an ESR below 10m and an ESL below 1.5nH is required for stability.
- Title
- Size:
- Date:
- A4
- Number:
- Time:
- Revision:
- Sheet
- of
- HTL Hollabrunn
- Abteilung Elektronik
- Anton Ehrenfried-Straße 10
- 2020 Hollabrunn
- File:
- Drawn By:

### Library data of the parts
C6-C9 C47-C50 = Capacitor: as C55 on sheet Top_Sheet; Published: 8-Jun-2000; LatestRevisionDate: 17-Jul-2002; LatestRevisionNote: Re-released for DXP Platform.; PackageReference: RAD-0.3; Publisher: Altium Limited; PackageDescription: Radial Cap, Thru-Hole; 2 Leads; 0.3 in Pin Spacing; Orderingcode: *
  C6 C8 C47 C49: Value: 10uF
  C7 C9: Value: 4.7uF
  C48 C50: Value: 100nF
R5-R8 = ResistorSMD: as R2 on sheet Source_TIA; Published: 8-Jun-2000; LatestRevisionDate: 17-Jul-2002; LatestRevisionNote: Re-released for DXP Platform.; PackageReference: AXIAL-0.4; Publisher: Altium Limited; PackageDescription: Axial Device, Thru-Hole; 2 Leads; 0.4 in Pin Spacing; Orderingcode: *
  R5 R8: Value: 78.7k
  R6 R7: Value: 0
U1 = LT3042EMSETRPBF: as U10 on sheet Analog_PSU_5; Type: Power Management; Copyright: Copyright (C) 2025 Ultra Librarian. All rights reserved.; Manufacturer_Part_Number: LT3042EMSE#TRPBF; RefDes: RefDes
U2 = LT3094EMSETRPBF: âˆ’20V, 500mA, Ultralow Noise, Ultrahigh PSRR Negative Linear Regulator; Manufacturer_Name: Analog Devices Inc; Copyright: Copyright (C) 2025 Ultra Librarian. All rights reserved.; Manufacturer_Part_Number: LT3094EMSE#TRPBF; RefDes: RefDes; Type: Type

## Sheet CortexM3_dev.SchDoc: Cortex M3 Dev and Memory
size A4; DrawnBy: Watzek; Organization: HTL Hollabrunn; Address1: Abteilung Elektronik; Address2: Anton Ehrenfried-Straße 10; Address3: 2020 Hollabrunn; DocumentNumber: 06; Revision: 01; SheetNumber: 06; SheetTotal: 12; SPICEModelCacheGTJPSRCJ: <root> / <DocumentId>GTJPSRCJ</DocumentId> / <CacheFrame Number="0"> / <Model Name="led0" Kind="MDL"> / <Text>*Typ INFRARED GaAs LED: Vf=1.2V Vr=5V If=40mA trr=3uS / *LED Pinout: 1=A, 2=K / .MODEL LED0 D (IS=93.5P RS=84M N=2.63 BV=5 IBV=10U / + CJO=2.97P VJ=.75 M=.333 TT=4.32U)</Text> / </Model> / </CacheFrame> / </root>
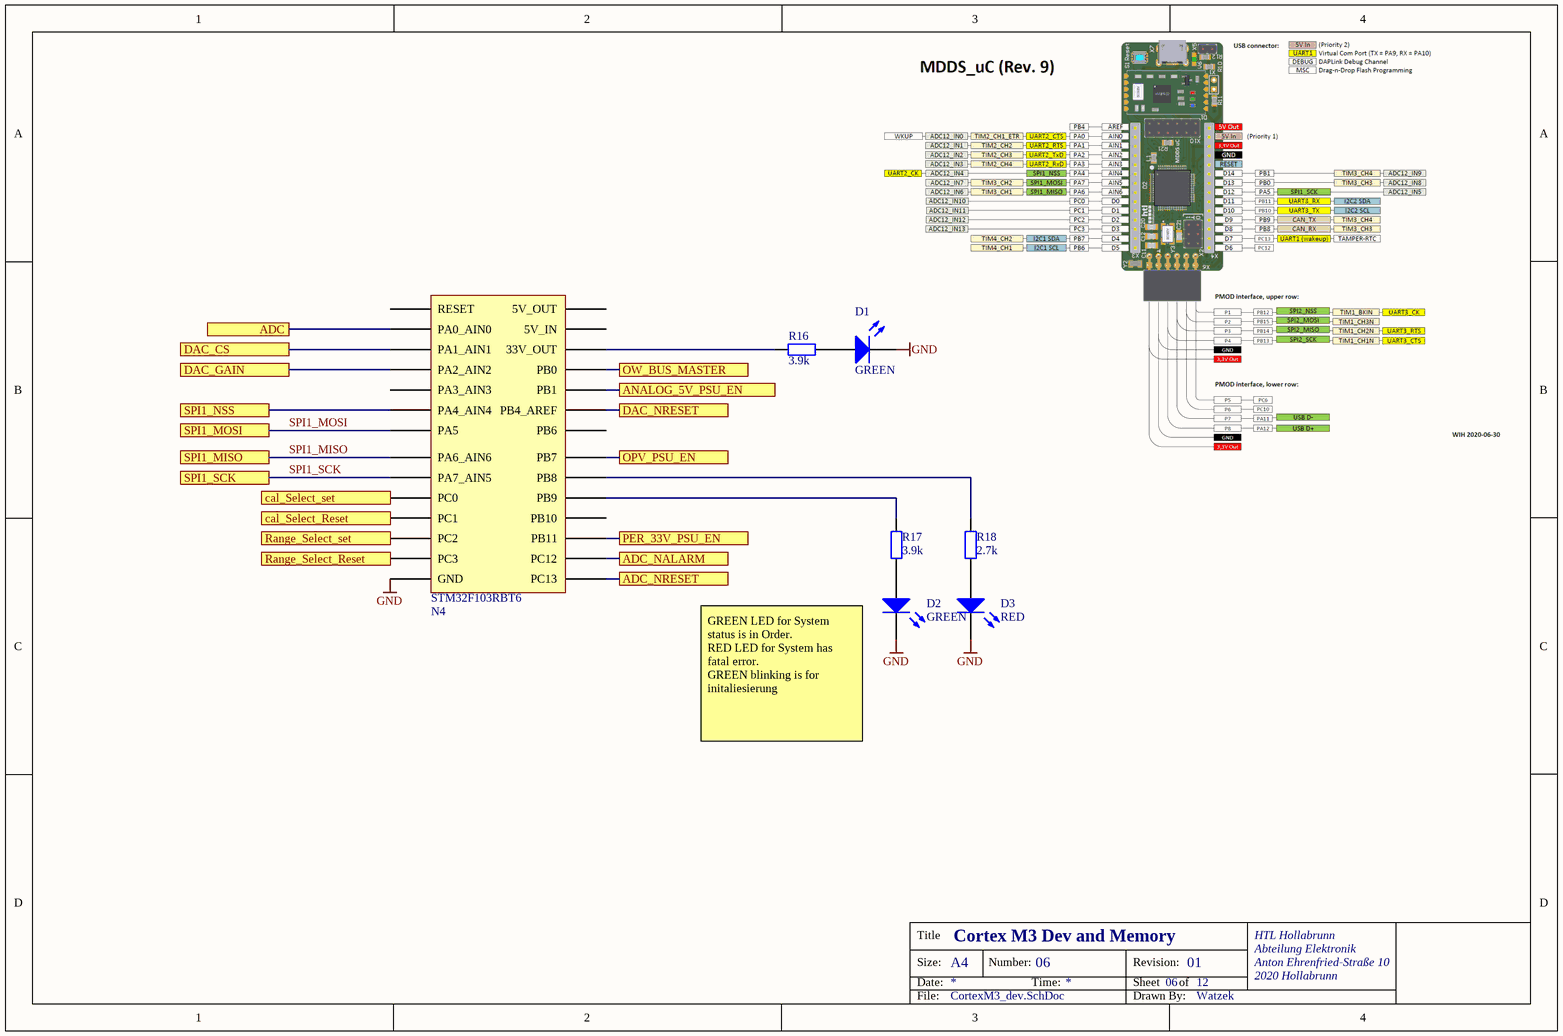
[diagram p9: CortexM3_dev.SchDoc]

### Parts
D1  GREEN  [6-0805_N-KUE]
D2  GREEN  [6-0805_N-KUE]
D3  RED  [6-0805_N-KUE]
N4  STM32F103  [DIP28]  (value not drawn)
R16  3.9k  [C1206-KUE]
R17  3.9k  [C1206-KUE]
R18  2.7k  [C1206-KUE]

### Ports
ADC, ADC_NALARM, ADC_NRESET, ANALOG_5V_PSU_EN, cal_Select_Reset, cal_Select_set, DAC_CS, DAC_GAIN, DAC_NRESET, OPV_PSU_EN, OW_BUS_MASTER, PER_33V_PSU_EN, Range_Select_Reset, Range_Select_set, SPI1_MISO, SPI1_MOSI, SPI1_NSS, SPI1_SCK

### Nets
GND: D1.2(K) D2.2(K) D3.2(K) N4.18(GND)
SPI1_MISO: N4.8(PA6_AIN6) ; port SPI1_MISO
SPI1_MOSI: N4.22(PA5) ; port SPI1_MOSI
SPI1_SCK: N4.7(PA7_AIN5) ; port SPI1_SCK
NetD1_1: D1.1(A) R16.2
NetD2_1: D2.1(A) R17.2
NetD3_1: D3.1(A) R18.2
NetN3_11: N4.6(PA4_AIN4) ; port SPI1_NSS
NetN3_14: N4.28(PC12) ; port ADC_NALARM
NetN4_1: N4.1(PB4_AREF) ; port DAC_NRESET
NetN4_2: N4.2(PA0_AIN0) ; port ADC
NetN4_3: N4.3(PA1_AIN1) ; port DAC_CS
NetN4_4: N4.4(PA2_AIN2) ; port DAC_GAIN
NetN4_9: N4.9(PC0) ; port cal_Select_set
NetN4_10: N4.10(PC1) ; port cal_Select_Reset
NetN4_11: N4.11(PC2) ; port Range_Select_set
NetN4_12: N4.12(PC3) ; port Range_Select_Reset
NetN4_13: N4.13(PB7) ; port OPV_PSU_EN
NetN4_17: N4.17(33V_OUT) R16.1
NetN4_20: N4.20(PB1) ; port ANALOG_5V_PSU_EN
NetN4_21: N4.21(PB0) ; port OW_BUS_MASTER
NetN4_23: N4.23(PB11) ; port PER_33V_PSU_EN
NetN4_25: N4.25(PB9) R17.1
NetN4_26: N4.26(PB8) R18.1
NetN4_27: N4.27(PC13) ; port ADC_NRESET

Not connected (* = marked no-connect by the designer): N4 5(PA3_AIN3) 14(PB6) 15(5V_OUT) 16(5V_IN) 19(RESET) 24(PB10)

### Notes on the sheet
- (near D2) GREEN LED for System status is in Order.
  RED LED for System has fatal error.
  GREEN blinking is for initaliesierung
- Title
- Size:
- Date:
- A4
- Number:
- Time:
- Revision:
- Sheet
- of
- HTL Hollabrunn
- Abteilung Elektronik
- Anton Ehrenfried-Straße 10
- 2020 Hollabrunn
- File:
- Drawn By:
- (in symbol STM32F103) STM32F103RBT6

### Library data of the parts
D1-D3 = LED0: Typical INFRARED GaAs LED; Published: 8-Jun-2000; LatestRevisionDate: 08-Jul-2005; LatestRevisionNote: Mech Layer 1 removed.; PackageReference: LED-0; Publisher: Altium Limited; PackageDescription: LED; 2 Leads
R16-R18 = ResistorSMD: as R2 on sheet Source_TIA; Published: 8-Jun-2000; LatestRevisionDate: 17-Jul-2002; LatestRevisionNote: Re-released for DXP Platform.; PackageReference: AXIAL-0.4; Publisher: Altium Limited; PackageDescription: Axial Device, Thru-Hole; 2 Leads; 0.4 in Pin Spacing; Orderingcode: *
  R16 R17: Value: 3.9k
  R18: Value: 2.7k

## Sheet Cal.SchDoc: Relai MOSFET Controller
size A4; DrawnBy: Michael Watzek; Organization: HTL Hollabrunn; Address1: Abteilung Elektronik; Address2: Anton Ehrenfried-Straße 10; Address3: 2020 Hollabrunn; DocumentNumber: 12; Revision: 01; SheetNumber: 12; SheetTotal: 12
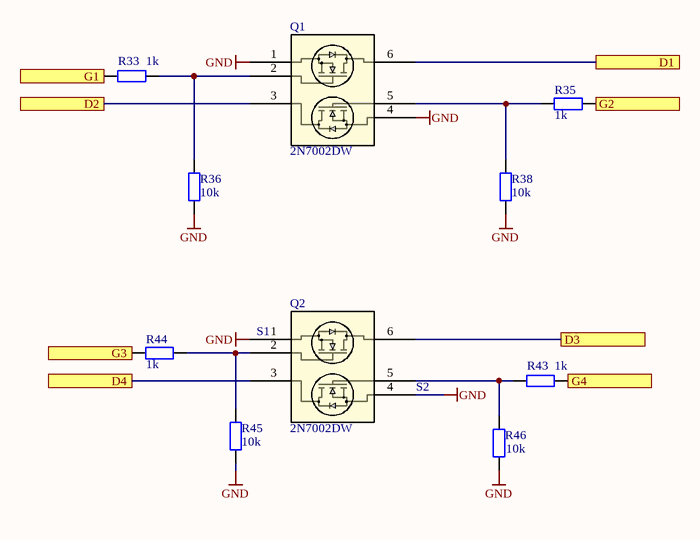
[diagram p10: Cal.SchDoc]

### Parts
Q1  2N7002DW  [SC-88SC70-6SOT-363_419B-02_ONS_OSI]
Q2  2N7002DW  [SC-88SC70-6SOT-363_419B-02_ONS_OSI]
R33  1k  [C1206-KUE]
R35  1k  [C1206-KUE]
R36  10k  [C1206-KUE]
R38  10k  [C1206-KUE]
R43  1k  [C1206-KUE]
R44  1k  [C1206-KUE]
R45  10k  [C1206-KUE]
R46  10k  [C1206-KUE]

### Ports
D1, D2, D3, D4, G1, G2, G3, G4

### Nets
GND: Q1.1 Q1.4 Q2.1 Q2.4 R36.2 R38.2 R45.2 R46.2
NetD5_2: Q1.3 ; port D2
NetD6_2: Q1.6 ; port D1
NetD7_2: Q2.6 ; port D3
NetD8_2: Q2.3 ; port D4
NetN4_9: R44.2 ; port G3
NetN4_10: R43.1 ; port G4
NetN4_11: R35.2 ; port G2
NetN4_12: R33.2 ; port G1
NetQ1_2: Q1.2 R33.1 R36.1
NetQ1_5: Q1.5 R35.1 R38.1
NetQ2_2: Q2.2 R44.1 R45.1
NetQ2_5: Q2.5 R43.2 R46.1

### Notes on the sheet
- (near Q2) S1
- (near Q2) S2
- Title
- Size:
- Date:
- A4
- Number:
- Time:
- Revision:
- Sheet
- of
- HTL Hollabrunn
- Abteilung Elektronik
- Anton Ehrenfried-Straße 10
- 2020 Hollabrunn
- File:
- Drawn By:

### Library data of the parts
Q1 Q2 = 2N7002DW: Description; Manufacturer_Name: onsemi; Copyright: Copyright (C) 2026 Ultra Librarian. All rights reserved.; Manufacturer_Part_Number: 2N7002DW; RefDes: RefDes; Type: Type
R33 R35 R36 R38 R43-R46 = ResistorSMD: as R2 on sheet Source_TIA; Published: 8-Jun-2000; LatestRevisionDate: 17-Jul-2002; LatestRevisionNote: Re-released for DXP Platform.; PackageReference: AXIAL-0.4; Publisher: Altium Limited; PackageDescription: Axial Device, Thru-Hole; 2 Leads; 0.4 in Pin Spacing; Orderingcode: *
  R33 R35 R43 R44: Value: 1k
  R36 R38 R45 R46: Value: 10k

## Nets that join several sheets
AVDD: ADC_8681 (C13.2 C51.2 N3.2), AD_5689_DAC (C15.2 C16.2 U3.5), Analog_PSU_5 (C27.2 C54.2 U10.9 U10.10)
DVDD: Source_TIA (8 pins), ADC_8681 (5 pins), AD_5689_DAC (C18.2 R12.1 R13.1 U3.11), Temp_Sensors (C53.2 R39.1 R47.1 U9.3), Digital_Psu (C34.2 C35.2 U12.1 U12.2)
GND: Top_Sheet (9 pins), Source_TIA (10 pins), DAC_Buffer_Filter (10 pins), ADC_8681 (11 pins), AD_5689_DAC (7 pins), Temp_Sensors (C53.1 U9.1 U16.1), Digital_Psu (6 pins), Analog_PSU_5 (7 pins), OPV_psu (15 pins), CortexM3_dev (D1.2 D2.2 D3.2 N4.18), Cal (8 pins)
neg_out: Source_TIA (5 pins), DAC_Buffer_Filter (6 pins), OPV_psu (5 pins)
pos_out: Source_TIA (5 pins), DAC_Buffer_Filter (6 pins), OPV_psu (C6.2 C48.2 U1.9 U1.10)
M_source: Top_Sheet (P1.1), Source_TIA (6 pins)
NetC36_2: Top_Sheet (P12.2), Digital_Psu (C36.2 U12.8)
NetC47_2: Top_Sheet (P4.2), OPV_psu (C47.2 U1.1 U1.2 U1.6)
NetC49_2: Top_Sheet (P4.4), OPV_psu (5 pins)
NetC55_2: Top_Sheet (C55.2 P5.2), Analog_PSU_5 (U10.1 U10.2 U10.3 U10.6)
NetD5_2: Source_TIA (D5.2 K1.7), Cal (Q1.3)
NetD6_2: Source_TIA (D6.2 K1.12), Cal (Q1.6)
NetD7_2: Source_TIA (D7.2 K2.7), Cal (Q2.6)
NetD8_2: Source_TIA (D8.2 K2.12), Cal (Q2.3)
NetN3_7: Source_TIA (R4.1), ADC_8681 (N3.7)
NetN3_11: ADC_8681 (N3.11 R11.2), CortexM3_dev (N4.6)
NetN3_14: ADC_8681 (N3.14), CortexM3_dev (N4.28)
NetN4_1: AD_5689_DAC (R12.2 U3.15), CortexM3_dev (N4.1)
NetN4_2: Top_Sheet (P9.1), CortexM3_dev (N4.2)
NetN4_3: AD_5689_DAC (R13.2 U3.13), CortexM3_dev (N4.3)
NetN4_4: AD_5689_DAC (U3.10), CortexM3_dev (N4.4)
NetN4_9: CortexM3_dev (N4.9), Cal (R44.2)
NetN4_10: CortexM3_dev (N4.10), Cal (R43.1)
NetN4_11: CortexM3_dev (N4.11), Cal (R35.2)
NetN4_12: CortexM3_dev (N4.12), Cal (R33.2)
NetN4_13: OPV_psu (U1.3 U2.3), CortexM3_dev (N4.13)
NetN4_21: Temp_Sensors (P10.1 P11.1), CortexM3_dev (N4.21)
NetN4_23: Digital_Psu (U12.5), CortexM3_dev (N4.23)
NetN4_27: ADC_8681 (R10.1), CortexM3_dev (N4.27)
NetP2_1: Top_Sheet (P2.1), DAC_Buffer_Filter (U7.1 U7.4)
NetP3_1: Top_Sheet (P3.1), DAC_Buffer_Filter (U8.1 U8.4)
NetR19_1: DAC_Buffer_Filter (R19.1), AD_5689_DAC (U3.3)
NetR20_1: DAC_Buffer_Filter (R20.1), AD_5689_DAC (U3.7)
SPI1_MISO: ADC_8681 (N3.13), AD_5689_DAC (U3.8), CortexM3_dev (N4.8)
SPI1_MOSI: ADC_8681 (N3.10), AD_5689_DAC (U3.14), CortexM3_dev (N4.22)
SPI1_SCK: ADC_8681 (N3.12), AD_5689_DAC (U3.12), CortexM3_dev (N4.7)